# Altium schematic sheet Blackbox_aaa_Empty_PCB_4_Layers.SchDoc: Title
size A3; Date: not used; ApprovedBy: not used; CheckedBy: not used; Author: not used; CompanyName: not used; DrawnBy: Drawn by; Engineer: not used; Organization: SMS-Lab; Address1: not used; Address2: not used; Address3: not used; Address4: not used; DocumentNumber: SMS-yyyy.m; Revision: 0; Time: not used; ModifiedDate: not used; ImagePath: not used
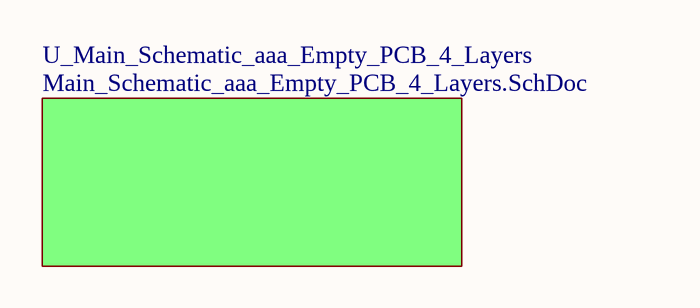
[diagram p0: Blackbox_aaa_Empty_PCB_4_Layers.SchDoc]

## Sub-sheets
U_Main_Schematic_aaa_Empty_PCB_4_Layers = Main_Schematic_aaa_Empty_PCB_4_Layers.SchDoc: no entries

## Notes on the sheet
- Date:
- Title of drawing:
- Time:
- Drawn by:
- Project:
- Revision:
- Page:
- from:
- File: